# Altium schematic sheet EE-10_Breakout.SchDoc: EE-10 Breakout
size A4; Revision: 1.0; SheetNumber: 1; SheetTotal: 1
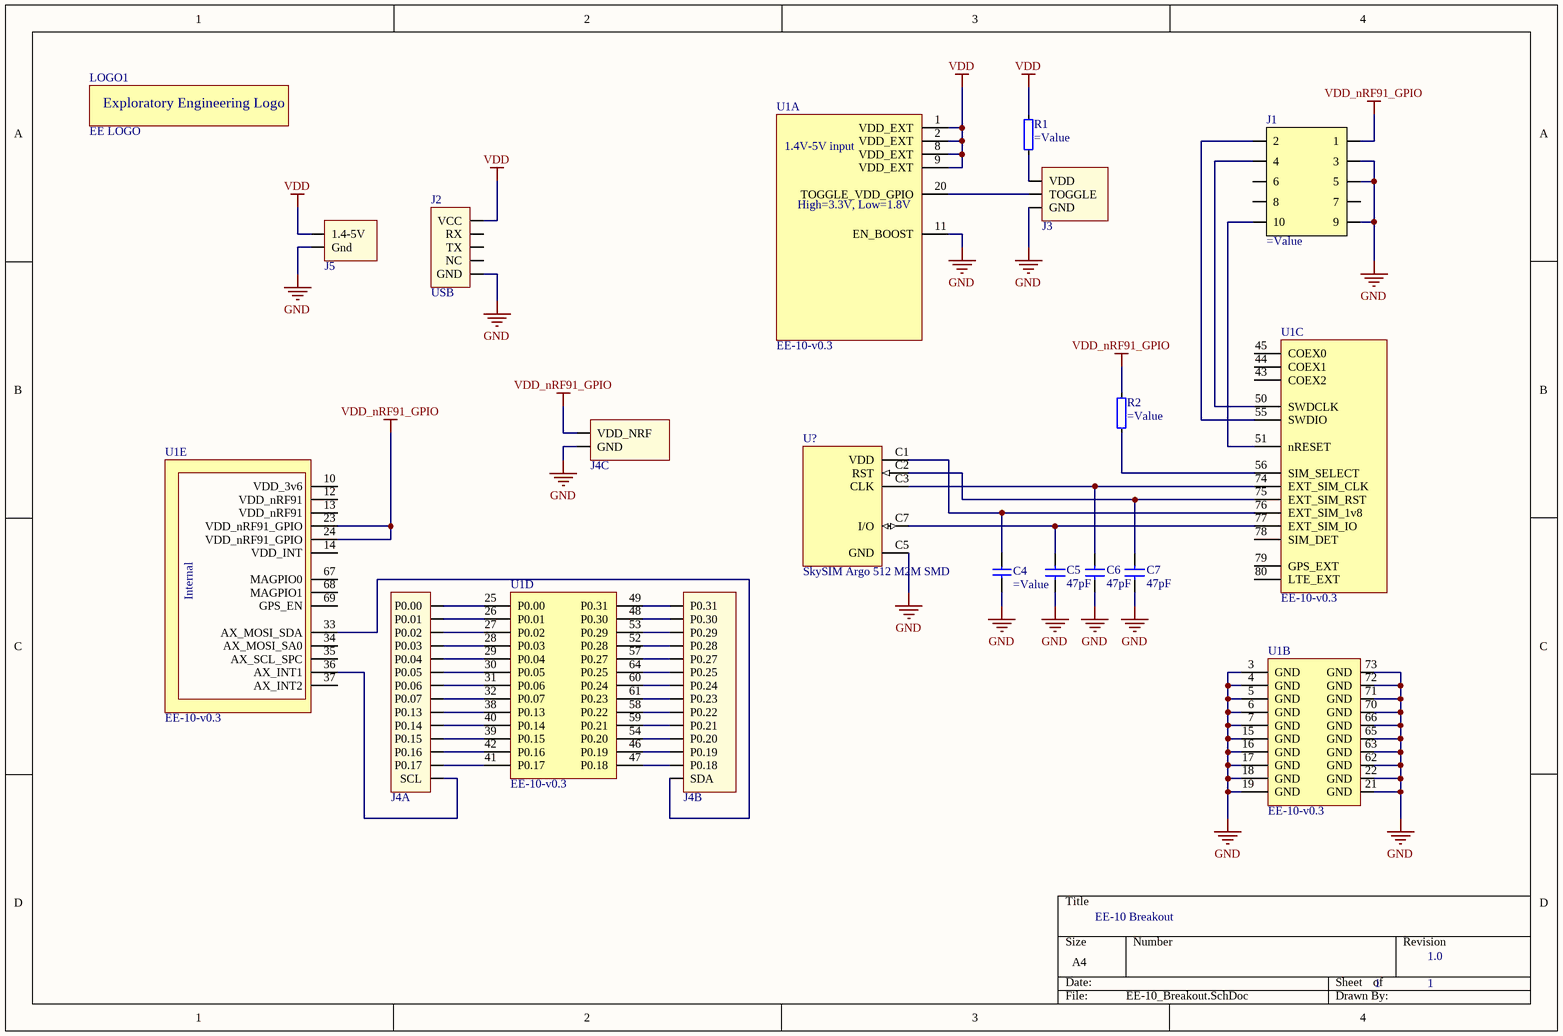
[diagram p0: EE-10_Breakout.SchDoc]

## Parts
C4  (no value)  [CAPC1005X04L]
C5  47pF  [CAPC1005X04L]
C6  47pF  [CAPC1005X04L]
C7  47pF  [CAPC1005X04L]
J1  (no value)  [FTSH-105-K]
J2  USB  [USB_10118192-0001LF]
J3  VOLTAGE_SELECTOR  [JUMPER_SELECTOR]  (value not drawn)
J4  EE-10_Breakout  [nRF91_BREAKOUT]  (value not drawn)  (parts A,B,C of 3)
J5  1.4-5V  [BATTERY_SOLDER_CONNECTOR]  (value not drawn)
LOGO1  EE LOGO  [EE_LOGO]
R1  (no value)  [RESC1005X04L]
R2  (no value)  [RESC1005X04L]
U1  EE-10-v0.3  [EE-10_V0.3]  (parts A,B,C,D,E of 5)
U?  SkySIM Argo 512 M2M SMD  [DUAL_SIM_FOOTPRINT]

## Nets
GND: C4.1 C5.2 C6.2 C7.2 J1.3 J1.5 J1.9 J2.5(GND) J3.3(GND) J4.30(GND) J5.2(Gnd) U1.3(GND) U1.4(GND) U1.5(GND) U1.6(GND) U1.7(GND) U1.11(EN_BOOST) U1.15(GND) U1.16(GND) U1.17(GND) U1.18(GND) U1.19(GND) U1.21(GND) U1.22(GND) U1.62(GND) U1.63(GND) U1.65(GND) U1.66(GND) U1.70(GND) U1.71(GND) U1.72(GND) U1.73(GND) U?.C5(GND)
VDD: J2.1(VCC) J5.1(1.4-5V) R1.2 U1.1(VDD_EXT) U1.2(VDD_EXT) U1.8(VDD_EXT) U1.9(VDD_EXT)
VDD_nRF91_GPIO: J1.1 J4.29(VDD_NRF) R2.2 U1.23(VDD_nRF91_GPIO) U1.24(VDD_nRF91_GPIO)
NetC4_2: C4.2 U1.76(EXT_SIM_1v8) U?.C1(VDD)
NetC5_1: C5.1 U1.77(EXT_SIM_IO) U?.C7(I/O)
NetC6_1: C6.1 U1.74(EXT_SIM_CLK) U?.C3(CLK)
NetC7_1: C7.1 U1.75(EXT_SIM_RST) U?.C2(RST)
NetJ1_2: J1.2 U1.55(SWDIO)
NetJ1_4: J1.4 U1.50(SWDCLK)
NetJ1_10: J1.10 U1.51(nRESET)
NetJ3_1: J3.1(VDD) R1.1
NetJ3_2: J3.2(TOGGLE) U1.20(TOGGLE_VDD_GPIO)
NetJ4_1: J4.1(P0.00) U1.25(P0.00)
NetJ4_2: J4.2(P0.01) U1.26(P0.01)
NetJ4_3: J4.3(P0.02) U1.27(P0.02)
NetJ4_4: J4.4(P0.03) U1.28(P0.03)
NetJ4_5: J4.5(P0.04) U1.29(P0.04)
NetJ4_6: J4.6(P0.05) U1.30(P0.05)
NetJ4_7: J4.7(P0.06) U1.31(P0.06)
NetJ4_8: J4.8(P0.07) U1.32(P0.07)
NetJ4_9: J4.9(P0.13) U1.38(P0.13)
NetJ4_10: J4.10(P0.14) U1.40(P0.14)
NetJ4_11: J4.11(P0.15) U1.39(P0.15)
NetJ4_12: J4.12(P0.16) U1.42(P0.16)
NetJ4_13: J4.13(P0.17) U1.41(P0.17)
NetJ4_14: J4.14(SCL) U1.36(AX_INT1)
NetJ4_15: J4.15(SDA) U1.33(AX_MOSI_SDA)
NetJ4_16: J4.16(P0.18) U1.47(P0.18)
NetJ4_17: J4.17(P0.19) U1.46(P0.19)
NetJ4_18: J4.18(P0.20) U1.54(P0.20)
NetJ4_19: J4.19(P0.21) U1.59(P0.21)
NetJ4_20: J4.20(P0.22) U1.58(P0.22)
NetJ4_21: J4.21(P0.23) U1.61(P0.23)
NetJ4_22: J4.22(P0.24) U1.60(P0.24)
NetJ4_23: J4.23(P0.25) U1.64(P0.25)
NetJ4_24: J4.24(P0.27) U1.57(P0.27)
NetJ4_25: J4.25(P0.28) U1.52(P0.28)
NetJ4_26: J4.26(P0.29) U1.53(P0.29)
NetJ4_27: J4.27(P0.30) U1.48(P0.30)
NetJ4_28: J4.28(P0.31) U1.49(P0.31)
NetR2_1: R2.1 U1.56(SIM_SELECT)

Not connected (* = marked no-connect by the designer): J1 6 7 8; J2 2(RX) 3(TX) 4(NC); U1 10(VDD_3v6) 12(VDD_nRF91) 13(VDD_nRF91) 14(VDD_INT) 34(AX_MOSI_SA0) 35(AX_SCL_SPC) 37(AX_INT2) 43(COEX2) 44(COEX1) 45(COEX0) 67(MAGPIO0) 68(MAGPIO1) 69(GPS_EN) 78(SIM_DET) 79(GPS_EXT) 80(LTE_EXT)

## Notes on the sheet
- (in symbol EE-10-v0.3, part A) 1.4V-5V input; High=3.3V, Low=1.8V
- (in symbol EE-10-v0.3, part E) Internal
- (in symbol EE-LOGO) Exploratory Engineering Logo

## Library data of the parts
C4 = GRM155R71C104KA88D: CAP CER 100nF 16V X7R 0402; Manufacturer: Murata Electronics North America; Tolerance: ±10%; Supplier 1: Digi-Key; Manufacturer Part Number: GRM155R71C104KA88D; RoHS: RoHS Compliant; Category: Capacitors; Stock 1: 24649903; Pricing 1: 1=0.16, 10=0.023, 50=0.0126, 100=0.0107, 250=0.00872, 500=0.00746, 1000=0.00581, 5000=0.00485 (EUR); Packaging: Digi-Reel®; Capacitance: 100nF; Voltage - Rated: 16V; Temperature Coefficient: X7R; Mounting Type: Surface Mount, MLCC; Operating Temperature: -55°C ~ 125°C; Applications: General Purpose; Ratings: -; Package / Case: 0402 (1005 Metric); Size / Dimension: 0.039" L x 0.020" W (1.00mm x 0.50mm); Height - Seated (Max): -; Thickness (Max): 0.022" (0.55mm); Lead Spacing: -; Features: -; Lead Style: -; ComponentLink1URL: http://www.murata.com/~/media/webrenewal/support/library/catalog/products/capacitor/mlcc/c02e.pdf; ComponentLink1Description: http://www.murata.com/~/media/webrenewal/support/library/catalog/products/capacitor/mlcc/c02e.pdf; Supplier Part Number 1: 490-3261-6-ND; Value: 100nF
C5-C7 = GRM1555C1H470FA01D: Multilayer Ceramic Capacitors MLCC - SMD/SMT 0402 47pF 50volts C0G 1%; Value: 47pF
J1 = FTSH-105-01-F-DV-K-P: CONN HEADER 10POS DUAL .05" SMD; Manufacturer: Samtec Inc.; Connector Type: Header, Shrouded; Number of Positions: 10; Number of Positions Loaded: All; Pitch: 0.050" (1.27mm); Supplier 1: Digi-Key; Manufacturer Part Number: FTSH-105-01-F-DV-K-P; RoHS: RoHS Compliant; Category: Connectors, Interconnects; Stock 1: 160; Pricing 1: 1=3.48, 10=2.948, 50=2.546, 100=2.278, 250=2.01, 500=1.876, 1000=1.742, 2500=1.675, 5000=1.6415 (USD); Packaging: Tube; Contact Type: Male Pin; Number of Rows: 2; Row Spacing: 0.050" (1.27mm); Contact Mating Length: 0.120" (3.05mm); Mounting Type: Surface Mount; Termination: Solder; Fastening Type: -; Features: -; Contact Finish: Gold; Contact Finish Thickness: 3µin (0.08µm); Color: Black; ComponentLink1URL: http://suddendocs.samtec.com/prints/ftsh-1xx-xx-xxx-dv-xxx-mkt.pdf; ComponentLink1Description: http://suddendocs.samtec.com/prints/ftsh-1xx-xx-xxx-dv-xxx-mkt.pdf; Supplier Part Number 1: SAM8797-ND; Value: FTSH-105-01-F-DV-K-P
J2 = 10118192-0001LF: USB - micro B USB 2.0 Receptacle Connector 5 Position Surface Mount, Right Angle, Horizontal
J5 = BATTERY_CONNECTOR
LOGO1 = EE-LOGO: Exploratory Engineering Logo Silkscreen
R1 R2 = RC0402FR-0710KL: RES SMD 10K OHM 1% 1/16W 0402; Manufacturer: Yageo; Power (Watts): 0.063W, 1/16W; Temperature Coefficient: ±100ppm/°C; Supplier 1: Digi-Key; Manufacturer Part Number: RC0402FR-0710KL; RoHS: RoHS Compliant; Category: Resistors; Stock 1: 3763255; Pricing 1: 1=0.1, 10=0.013, 25=0.0096, 100=0.0054, 250=0.00412, 500=0.00328, 1000=0.00242, 2500=0.0021, 5000=0.00173 (USD); Packaging: Digi-Reel®; Resistance (Ohms): 10k; Tolerance: ±1%; Composition: Thick Film; Features: Moisture Resistant; Operating Temperature: -55°C ~ 155°C; Package / Case: 0402 (1005 Metric); Supplier Device Package: 0402; Size / Dimension: 0.039" L x 0.020" W (1.00mm x 0.50mm); Height: 0.016" (0.40mm); Number of Terminations: 2; ComponentLink1URL: http://www.yageo.com/NewPortal/yageodocoutput?fileName=/pdf/R-Chip/PYu-RC_Group_51_RoHS_L_3.pdf; ComponentLink1Description: http://www.yageo.com/NewPortal/yageodocoutput?fileName=/pdf/R-Chip/PYu-RC_Group_51_RoHS_L_3.pdf; Supplier Part Number 1: 311-10.0KLRDKR-ND; Value: 10k
U1 = EE-10-v0.3: EE-10 v0.3 PCB Module; Manufacturer: Telenor; Manufacturer Part Number: EE-10-v0.3
U? = SKYSIM-ARGO-LTE-MFF2_1: SkySIM® Argo 512 M2M SMD - LTE; Value: SkySIM Argo 512 M2M SMD